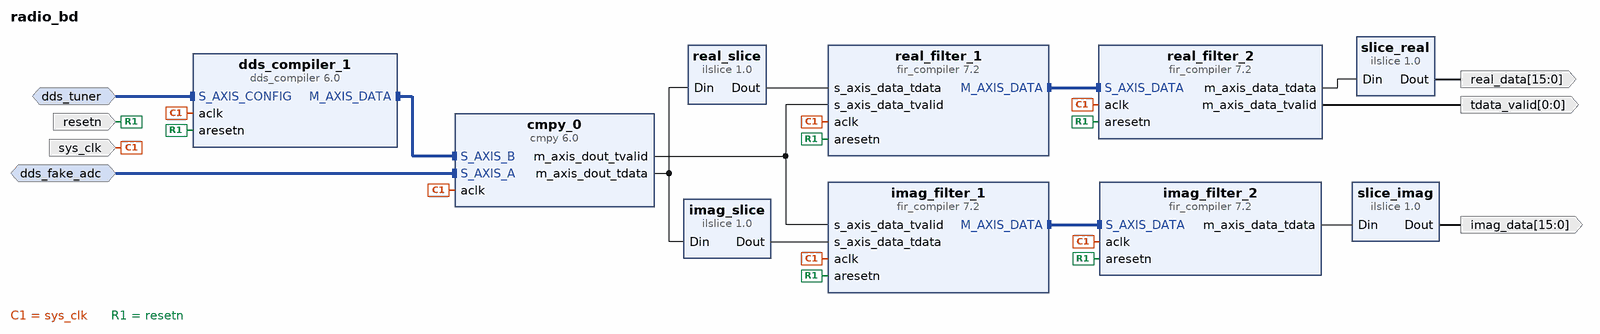
[diagram p0: block diagram of the top level]
# Vivado block design radio_bd, xc7z020clg400-1, Vivado 2025.2
create_bd_design radio_bd

create_bd_intf_port -mode Slave -vlnv xilinx.com:interface:axis_rtl:1.0 dds_fake_adc
set_property -dict [list \
  CONFIG.FREQ_HZ 125000000 \
  CONFIG.HAS_TKEEP 0 \
  CONFIG.HAS_TLAST 0 \
  CONFIG.HAS_TREADY 0 \
  CONFIG.HAS_TSTRB 0 \
  CONFIG.LAYERED_METADATA undef \
  CONFIG.TDATA_NUM_BYTES 4 \
  CONFIG.TDEST_WIDTH 0 \
  CONFIG.TID_WIDTH 0 \
  CONFIG.TUSER_WIDTH 0 \
] [get_bd_intf_ports dds_fake_adc]
create_bd_intf_port -mode Slave -vlnv xilinx.com:interface:axis_rtl:1.0 dds_tuner
set_property -dict [list \
  CONFIG.FREQ_HZ 125000000 \
  CONFIG.HAS_TKEEP 0 \
  CONFIG.HAS_TLAST 0 \
  CONFIG.HAS_TREADY 0 \
  CONFIG.HAS_TSTRB 0 \
  CONFIG.LAYERED_METADATA undef \
  CONFIG.TDATA_NUM_BYTES 4 \
  CONFIG.TDEST_WIDTH 0 \
  CONFIG.TID_WIDTH 0 \
  CONFIG.TUSER_WIDTH 0 \
] [get_bd_intf_ports dds_tuner]
create_bd_port -dir I -type clk sys_clk
set_property -dict {CONFIG.ASSOCIATED_RESET resetn CONFIG.FREQ_HZ 125000000} [get_bd_ports sys_clk]
create_bd_port -dir I -type rst resetn
create_bd_port -dir O -from 15 -to 0 real_data
create_bd_port -dir O -from 15 -to 0 imag_data
create_bd_port -dir O -from 0 -to 0 tdata_valid

create_bd_cell -type ip -vlnv xilinx.com:ip:cmpy:6.0 cmpy_0
set_property -dict {CONFIG.OutputWidth 19} [get_bd_cells cmpy_0]
create_bd_cell -type ip -vlnv xilinx.com:ip:fir_compiler:7.2 real_filter_1
set_property -dict [list \
  CONFIG.BestPrecision false \
  CONFIG.Clock_Frequency 125 \
  CONFIG.CoefficientSource COE_File \
  CONFIG.Coefficient_File ../../../fir1.coe \
  CONFIG.Coefficient_Fractional_Bits 15 \
  CONFIG.Coefficient_Sets 1 \
  CONFIG.Coefficient_Sign Signed \
  CONFIG.Coefficient_Structure Inferred \
  CONFIG.Coefficient_Width 16 \
  CONFIG.ColumnConfig 3 \
  CONFIG.DATA_Has_TLAST Not_Required \
  CONFIG.Data_Fractional_Bits 15 \
  CONFIG.Data_Width 16 \
  CONFIG.Decimation_Rate 40 \
  CONFIG.Filter_Architecture Systolic_Multiply_Accumulate \
  CONFIG.Filter_Type Decimation \
  CONFIG.Has_ARESETn true \
  CONFIG.Interpolation_Rate 1 \
  CONFIG.M_DATA_Has_TUSER Not_Required \
  CONFIG.Number_Channels 1 \
  CONFIG.Output_Width 32 \
  CONFIG.Quantization Quantize_Only \
  CONFIG.RateSpecification Frequency_Specification \
  CONFIG.S_DATA_Has_TUSER Not_Required \
  CONFIG.Sample_Frequency 125 \
  CONFIG.Select_Pattern All \
  CONFIG.Zero_Pack_Factor 1 \
] [get_bd_cells real_filter_1]
create_bd_cell -type inline_hdl -vlnv xilinx.com:inline_hdl:ilslice:1.0 real_slice
set_property -dict {CONFIG.DIN_FROM 39 CONFIG.DIN_TO 24 CONFIG.DIN_WIDTH 48} [get_bd_cells real_slice]
create_bd_cell -type inline_hdl -vlnv xilinx.com:inline_hdl:ilslice:1.0 imag_slice
set_property -dict {CONFIG.DIN_FROM 15 CONFIG.DIN_TO 0 CONFIG.DIN_WIDTH 48} [get_bd_cells imag_slice]
create_bd_cell -type ip -vlnv xilinx.com:ip:fir_compiler:7.2 imag_filter_1
set_property -dict [list \
  CONFIG.BestPrecision false \
  CONFIG.Clock_Frequency 125 \
  CONFIG.CoefficientSource COE_File \
  CONFIG.Coefficient_File ../../../fir1.coe \
  CONFIG.Coefficient_Fractional_Bits 15 \
  CONFIG.Coefficient_Sets 1 \
  CONFIG.Coefficient_Sign Signed \
  CONFIG.Coefficient_Structure Inferred \
  CONFIG.Coefficient_Width 16 \
  CONFIG.ColumnConfig 3 \
  CONFIG.DATA_Has_TLAST Not_Required \
  CONFIG.Data_Fractional_Bits 15 \
  CONFIG.Data_Width 16 \
  CONFIG.Decimation_Rate 40 \
  CONFIG.Filter_Architecture Systolic_Multiply_Accumulate \
  CONFIG.Filter_Type Decimation \
  CONFIG.Has_ARESETn true \
  CONFIG.Interpolation_Rate 1 \
  CONFIG.M_DATA_Has_TUSER Not_Required \
  CONFIG.Number_Channels 1 \
  CONFIG.Output_Width 32 \
  CONFIG.Quantization Quantize_Only \
  CONFIG.RateSpecification Frequency_Specification \
  CONFIG.S_DATA_Has_TUSER Not_Required \
  CONFIG.Sample_Frequency 125 \
  CONFIG.Select_Pattern All \
  CONFIG.Zero_Pack_Factor 1 \
] [get_bd_cells imag_filter_1]
create_bd_cell -type ip -vlnv xilinx.com:ip:fir_compiler:7.2 real_filter_2
set_property -dict [list \
  CONFIG.BestPrecision false \
  CONFIG.Clock_Frequency 125 \
  CONFIG.CoefficientSource COE_File \
  CONFIG.Coefficient_File ../../../fir2.coe \
  CONFIG.Coefficient_Fractional_Bits 15 \
  CONFIG.Coefficient_Sets 1 \
  CONFIG.Coefficient_Sign Signed \
  CONFIG.Coefficient_Structure Inferred \
  CONFIG.Coefficient_Width 16 \
  CONFIG.ColumnConfig 1 \
  CONFIG.DATA_Has_TLAST Not_Required \
  CONFIG.Data_Fractional_Bits 30 \
  CONFIG.Data_Sign Signed \
  CONFIG.Data_Width 32 \
  CONFIG.Decimation_Rate 64 \
  CONFIG.Filter_Architecture Systolic_Multiply_Accumulate \
  CONFIG.Filter_Type Decimation \
  CONFIG.Has_ARESETn true \
  CONFIG.Interpolation_Rate 1 \
  CONFIG.M_DATA_Has_TUSER Not_Required \
  CONFIG.Number_Channels 1 \
  CONFIG.Output_Rounding_Mode Truncate_LSBs \
  CONFIG.Output_Width 18 \
  CONFIG.Quantization Quantize_Only \
  CONFIG.RateSpecification Input_Sample_Period \
  CONFIG.S_DATA_Has_TUSER Not_Required \
  CONFIG.SamplePeriod 40 \
  CONFIG.Sample_Frequency 3.125 \
  CONFIG.Select_Pattern All \
  CONFIG.Zero_Pack_Factor 1 \
] [get_bd_cells real_filter_2]
create_bd_cell -type ip -vlnv xilinx.com:ip:fir_compiler:7.2 imag_filter_2
set_property -dict [list \
  CONFIG.BestPrecision false \
  CONFIG.Clock_Frequency 125 \
  CONFIG.CoefficientSource COE_File \
  CONFIG.Coefficient_File ../../../fir2.coe \
  CONFIG.Coefficient_Fractional_Bits 15 \
  CONFIG.Coefficient_Sets 1 \
  CONFIG.Coefficient_Sign Signed \
  CONFIG.Coefficient_Structure Inferred \
  CONFIG.Coefficient_Width 16 \
  CONFIG.ColumnConfig 1 \
  CONFIG.DATA_Has_TLAST Not_Required \
  CONFIG.Data_Fractional_Bits 30 \
  CONFIG.Data_Sign Signed \
  CONFIG.Data_Width 32 \
  CONFIG.Decimation_Rate 64 \
  CONFIG.Filter_Architecture Systolic_Multiply_Accumulate \
  CONFIG.Filter_Type Decimation \
  CONFIG.Has_ARESETn true \
  CONFIG.Interpolation_Rate 1 \
  CONFIG.M_DATA_Has_TUSER Not_Required \
  CONFIG.Number_Channels 1 \
  CONFIG.Output_Rounding_Mode Truncate_LSBs \
  CONFIG.Output_Width 18 \
  CONFIG.Quantization Quantize_Only \
  CONFIG.RateSpecification Input_Sample_Period \
  CONFIG.S_DATA_Has_TUSER Not_Required \
  CONFIG.SamplePeriod 40 \
  CONFIG.Sample_Frequency 3.125 \
  CONFIG.Select_Pattern All \
  CONFIG.Zero_Pack_Factor 1 \
] [get_bd_cells imag_filter_2]
create_bd_cell -type inline_hdl -vlnv xilinx.com:inline_hdl:ilslice:1.0 slice_imag
set_property -dict {CONFIG.DIN_FROM 15 CONFIG.DIN_WIDTH 24 CONFIG.DOUT_WIDTH 16} [get_bd_cells slice_imag]
create_bd_cell -type inline_hdl -vlnv xilinx.com:inline_hdl:ilslice:1.0 slice_real
set_property -dict {CONFIG.DIN_FROM 15 CONFIG.DIN_WIDTH 24 CONFIG.DOUT_WIDTH 16} [get_bd_cells slice_real]
create_bd_cell -type ip -vlnv xilinx.com:ip:dds_compiler:6.0 dds_compiler_1
set_property -dict [list \
  CONFIG.Amplitude_Mode Unit_Circle \
  CONFIG.DATA_Has_TLAST Not_Required \
  CONFIG.DDS_Clock_Rate 125 \
  CONFIG.Frequency_Resolution 0.4 \
  CONFIG.Has_ARESETn true \
  CONFIG.Latency 7 \
  CONFIG.Noise_Shaping None \
  CONFIG.OUTPUT_FORM Twos_Complement \
  CONFIG.Output_Frequency1 0 \
  CONFIG.Output_Width 16 \
  CONFIG.PINC1 10100111110001011 \
  CONFIG.Parameter_Entry Hardware_Parameters \
  CONFIG.Phase_Increment Programmable \
  CONFIG.Phase_Width 27 \
  CONFIG.Phase_offset None \
  CONFIG.S_PHASE_Has_TUSER Not_Required \
] [get_bd_cells dds_compiler_1]

# ---- connections ----

connect_bd_intf_net -intf_net S_AXIS_CONFIG_0_1 [get_bd_intf_ports dds_tuner] [get_bd_intf_pins dds_compiler_1/S_AXIS_CONFIG]
connect_bd_intf_net -intf_net dds_compiler_0_M_AXIS_DATA [get_bd_intf_pins dds_compiler_1/M_AXIS_DATA] [get_bd_intf_pins cmpy_0/S_AXIS_B]
connect_bd_intf_net [get_bd_intf_ports dds_fake_adc] [get_bd_intf_pins cmpy_0/S_AXIS_A]
connect_bd_intf_net [get_bd_intf_pins imag_filter_1/M_AXIS_DATA] [get_bd_intf_pins imag_filter_2/S_AXIS_DATA]
connect_bd_intf_net [get_bd_intf_pins real_filter_1/M_AXIS_DATA] [get_bd_intf_pins real_filter_2/S_AXIS_DATA]
connect_bd_net -net aclk_0_1 [get_bd_ports sys_clk] \
  [get_bd_pins imag_filter_1/aclk] [get_bd_pins cmpy_0/aclk] [get_bd_pins real_filter_1/aclk] \
  [get_bd_pins imag_filter_2/aclk] [get_bd_pins real_filter_2/aclk] [get_bd_pins dds_compiler_1/aclk]
connect_bd_net -net aresetn_0_1 [get_bd_ports resetn] \
  [get_bd_pins dds_compiler_1/aresetn] [get_bd_pins real_filter_1/aresetn] [get_bd_pins imag_filter_1/aresetn] \
  [get_bd_pins imag_filter_2/aresetn] [get_bd_pins real_filter_2/aresetn]
connect_bd_net [get_bd_pins cmpy_0/m_axis_dout_tdata] [get_bd_pins real_slice/Din] [get_bd_pins imag_slice/Din]
connect_bd_net [get_bd_pins cmpy_0/m_axis_dout_tvalid] [get_bd_pins real_filter_1/s_axis_data_tvalid] [get_bd_pins imag_filter_1/s_axis_data_tvalid]
connect_bd_net [get_bd_pins imag_filter_2/m_axis_data_tdata] [get_bd_pins slice_imag/Din]
connect_bd_net [get_bd_pins imag_slice/Dout] [get_bd_pins imag_filter_1/s_axis_data_tdata]
connect_bd_net [get_bd_pins real_filter_2/m_axis_data_tdata] [get_bd_pins slice_real/Din]
connect_bd_net [get_bd_pins real_filter_2/m_axis_data_tvalid] [get_bd_ports tdata_valid]
connect_bd_net [get_bd_pins real_slice/Dout] [get_bd_pins real_filter_1/s_axis_data_tdata]
connect_bd_net [get_bd_pins slice_imag/Dout] [get_bd_ports imag_data]
connect_bd_net [get_bd_pins slice_real/Dout] [get_bd_ports real_data]

set_property USER_COMMENTS.comment_0 {NOTE: pad 16 bits 0x0
for imag. input} [get_bd_cells /dds_fake_adc]

validate_bd_design
save_bd_design
